# Altium project New_Thermistor_Board.PrjPcb
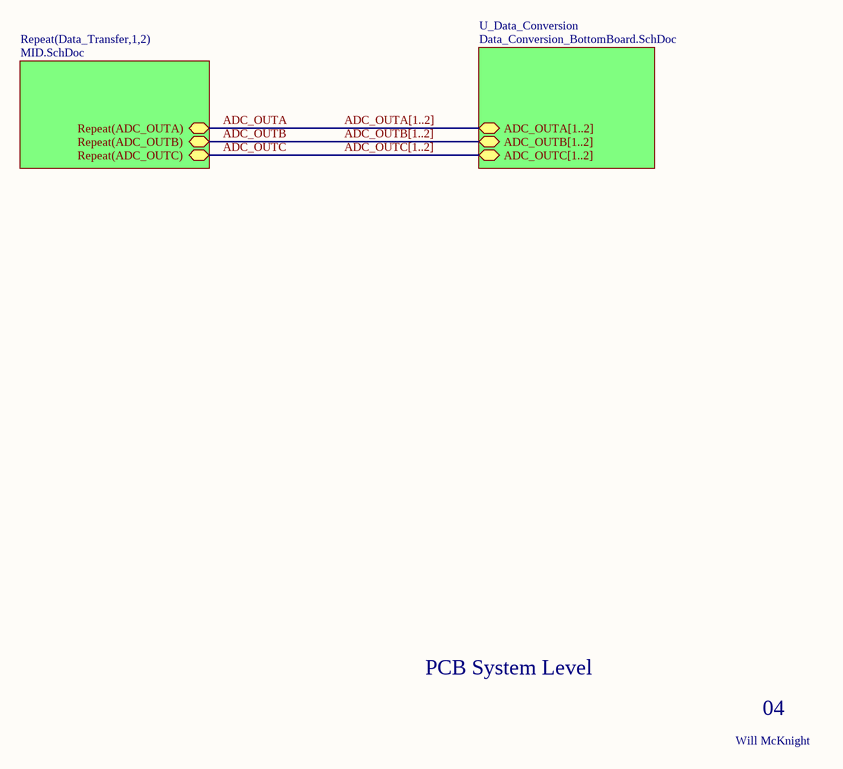
[diagram p0: TOP.SchDoc]
5 sheets, 66 parts. Net scope: hierarchical (ports join the sheet entries above them; power ports are global).
Board file: New_Bottom_Board.PcbDoc
Sheets:
  TOP.SchDoc
    Data_Transfer1 = MID.SchDoc
      U_AHK50H-ND_THERM_CONNECTOR = 50Pin_Connector.SchDoc
      U_Single_Mux = Multiplexers.SchDoc
    Data_Transfer2 = MID.SchDoc
      U_AHK50H-ND_THERM_CONNECTOR = 50Pin_Connector.SchDoc
      U_Single_Mux = Multiplexers.SchDoc
    U_Data_Conversion = Data_Conversion_BottomBoard.SchDoc

## Sheet TOP.SchDoc
size A; DocumentNumber: 2; SheetNumber: 2; SheetTotal: 5

### Sub-sheets
Repeat(Data_Transfer,1,2) = MID.SchDoc: Repeat(ADC_OUTA) (bidir), Repeat(ADC_OUTB) (bidir), Repeat(ADC_OUTC) (bidir)
U_Data_Conversion = Data_Conversion_BottomBoard.SchDoc: ADC_OUTA[1..2] (bidir), ADC_OUTB[1..2] (bidir), ADC_OUTC[1..2] (bidir)

### Nets
ADC_OUTA: sheet Repeat(Data_Transfer,1,2)/Repeat(ADC_OUTA)
ADC_OUTB: sheet Repeat(Data_Transfer,1,2)/Repeat(ADC_OUTB)
ADC_OUTC: sheet Repeat(Data_Transfer,1,2)/Repeat(ADC_OUTC)

### Buses and harness runs
bus ADC_OUTA[1..2] = sheet U_Data_Conversion/ADC_OUTA[1..2]
bus ADC_OUTB[1..2] = sheet U_Data_Conversion/ADC_OUTB[1..2]
bus ADC_OUTC[1..2] = sheet U_Data_Conversion/ADC_OUTC[1..2]

### Notes on the sheet
- PCB System Level
- 04
- Will McKnight

## Sheet MID.SchDoc
size A
Used 2 times, as channels Data_Transfer1, Data_Transfer2. Parts and nets are listed once, with the designators drawn on the sheet.
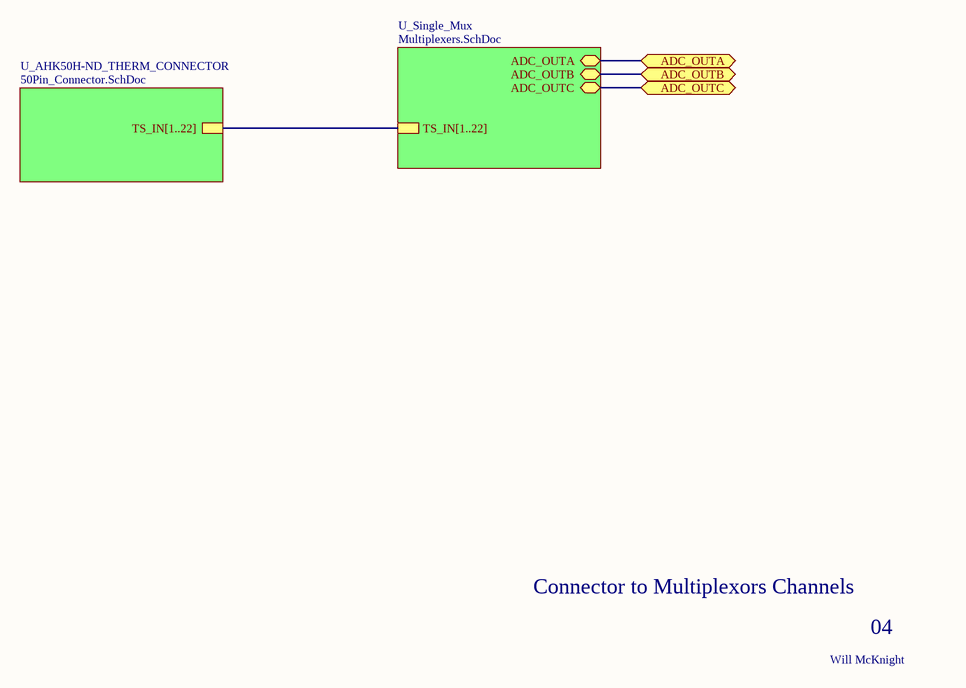
[diagram p1: MID.SchDoc]

### Sub-sheets
U_AHK50H-ND_THERM_CONNECTOR = 50Pin_Connector.SchDoc: TS_IN[1..22]
U_Single_Mux = Multiplexers.SchDoc: ADC_OUTA (bidir), TS_IN[1..22], ADC_OUTB (bidir), ADC_OUTC (bidir)

### Ports
ADC_OUTA (bidir), ADC_OUTB (bidir), ADC_OUTC (bidir)

### Nets
ADC_OUTA: port ADC_OUTA, sheet U_Single_Mux/ADC_OUTA
ADC_OUTB: port ADC_OUTB, sheet U_Single_Mux/ADC_OUTB
ADC_OUTC: port ADC_OUTC, sheet U_Single_Mux/ADC_OUTC

### Channels
Data_Transfer1: ports ADC_OUTA=ADC_OUTA ADC_OUTB=ADC_OUTB ADC_OUTC=ADC_OUTC
Data_Transfer2: ports ADC_OUTA=ADC_OUTA ADC_OUTB=ADC_OUTB ADC_OUTC=ADC_OUTC

### Buses and harness runs
bus sheet U_AHK50H-ND_THERM_CONNECTOR/TS_IN[1..22] = sheet U_Single_Mux/TS_IN[1..22]

### Notes on the sheet
- Connector to Multiplexors Channels
- 04
- Will McKnight

## Sheet 50Pin_Connector.SchDoc
size A; DocumentNumber: 1; SheetNumber: 1; SheetTotal: 5
Used 2 times, as channels Data_Transfer1/U_AHK50H-ND_THERM_CONNECTOR, Data_Transfer2/U_AHK50H-ND_THERM_CONNECTOR. Parts and nets are listed once, with the designators drawn on the sheet.
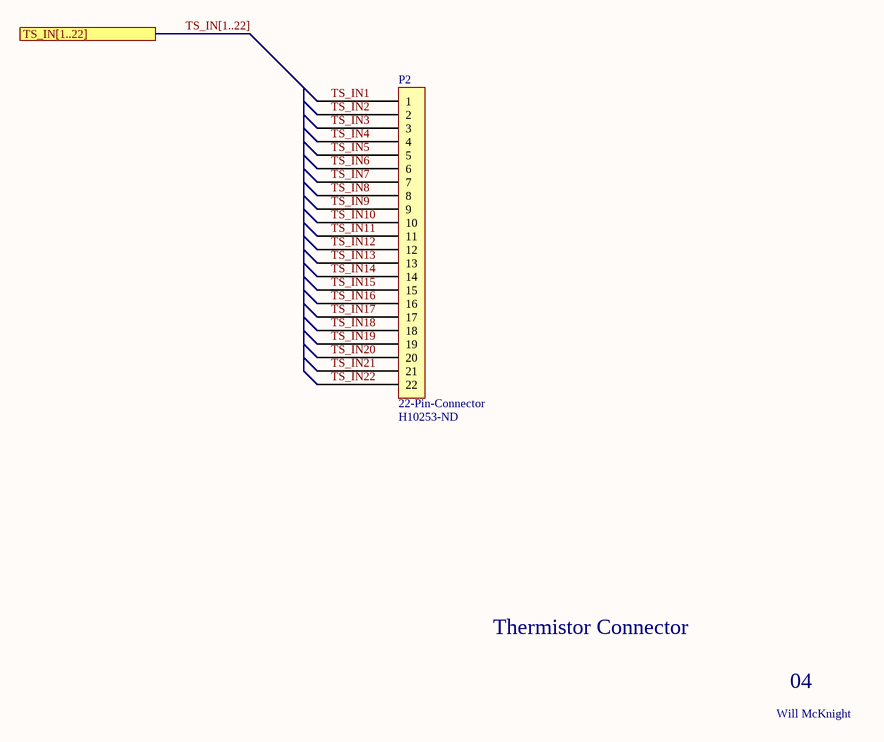
[diagram p2: 50Pin_Connector.SchDoc]

### Parts
P2  22-Pin-Connector  Supplier Part Number 1: H10253-ND  [22-Pin Conenctor]

### Ports
TS_IN[1..22]

### Nets
TS_IN1: P2.1
TS_IN2: P2.2
TS_IN3: P2.3
TS_IN4: P2.4
TS_IN5: P2.5
TS_IN6: P2.6
TS_IN7: P2.7
TS_IN8: P2.8
TS_IN9: P2.9
TS_IN10: P2.10
TS_IN11: P2.11
TS_IN12: P2.12
TS_IN13: P2.13
TS_IN14: P2.14
TS_IN15: P2.15
TS_IN16: P2.16
TS_IN17: P2.17
TS_IN18: P2.18
TS_IN19: P2.19
TS_IN20: P2.20
TS_IN21: P2.21
TS_IN22: P2.22

### Channels
Data_Transfer1/U_AHK50H-ND_THERM_CONNECTOR: designators end in _1
Data_Transfer2/U_AHK50H-ND_THERM_CONNECTOR: designators end in _2

### Buses and harness runs
bus TS_IN[1..22] = port TS_IN[1..22]

### Notes on the sheet
- Thermistor Connector
- 04
- Will McKnight

### Library data of the parts
P2 = 22-Pin-Connector: Current Therm Connector; Manufacturer: Hirose; Manufacturer Part Number: DF11-22DP-2DS(24); Number of Contacts: 22; Gender: Male; Connector Type: Male Pin; Contact Resistance: 30mR; Max Current Rating: 2A; Voltage Rating: 250V; Pitch: 2mm; Row Spacing: 0.079inch; Supplier 1: Digi-Key; Stock 1: 3536; Pricing 1: 1=1.19, 20=1.0455, 100=0.902, 500=0.738, 1000=0.656 (USD); Mount: Through Hole; Contact Plating: Tin; Contact Material: Brass,Copper Alloy,Tin; Color: Black; Housing Color: Black; Housing Material: Polyamide; Min Operating Temperature: -30°C; Max Operating Temperature: 85°C; Number of Rows: 2; Termination: Solder; Packaging: Rail/Tube; Package Quantity: 20; Fastening Type: Detent; Number of Positions: 22; Current Rating: 2A; Orientation: Right Angle; Length: 24mm; Height: 5mm; Contact Mating Length: 0.118inch; Depth: 10mm; Radiation Hardening: No; Lead Free: Lead Free; ComponentLink1URL: http://docs-usa.electrocomponents.com/techlib:/itc_doclist_US.htm?stockno=6888963&src-supplier=Allied+Electronics; ComponentLink1Description: http://docs-usa.electrocomponents.com/techlib:/itc_doclist_US.htm?stockno=6888963&src-supplier=Allied+Electronics; ComponentLink2URL: https://www.verical.com/server-webapp/html/getDatasheet?partID=456315&src-supplier=Verical; ComponentLink2Description: https://www.verical.com/server-webapp/html/getDatasheet?partID=456315&src-supplier=Verical; ComponentLink3URL: http://www.hirose.co.jp/cataloge_hp/en_DF11_20130411.pdf?src-supplier=Future+Electronics; ComponentLink3Description: http://www.hirose.co.jp/cataloge_hp/en_DF11_20130411.pdf?src-supplier=Future+Electronics; ComponentLink4URL: http://www.farnell.com/datasheets/91550.pdf?src-supplier=Element14; ComponentLink4Description: http://www.farnell.com/datasheets/91550.pdf?src-supplier=Element14; ComponentLink5URL: http://www.mouser.com/ds/2/185/DF11_catalog-1064296.pdf?src-supplier=Mouser; ComponentLink5Description: http://www.mouser.com/ds/2/185/DF11_catalog-1064296.pdf?src-supplier=Mouser; ComponentLink6URL: http://documents.rs-components.com/techlib://itc_doclist_GB.htm?stockno=6056598&src-supplier=RSComponents; ComponentLink6Description: http://documents.rs-components.com/techlib://itc_doclist_GB.htm?stockno=6056598&src-supplier=RSComponents

## Sheet Multiplexers.SchDoc
size A; DocumentNumber: 5; SheetNumber: 5; SheetTotal: 5
Used 2 times, as channels Data_Transfer1/U_Single_Mux, Data_Transfer2/U_Single_Mux. Parts and nets are listed once, with the designators drawn on the sheet.
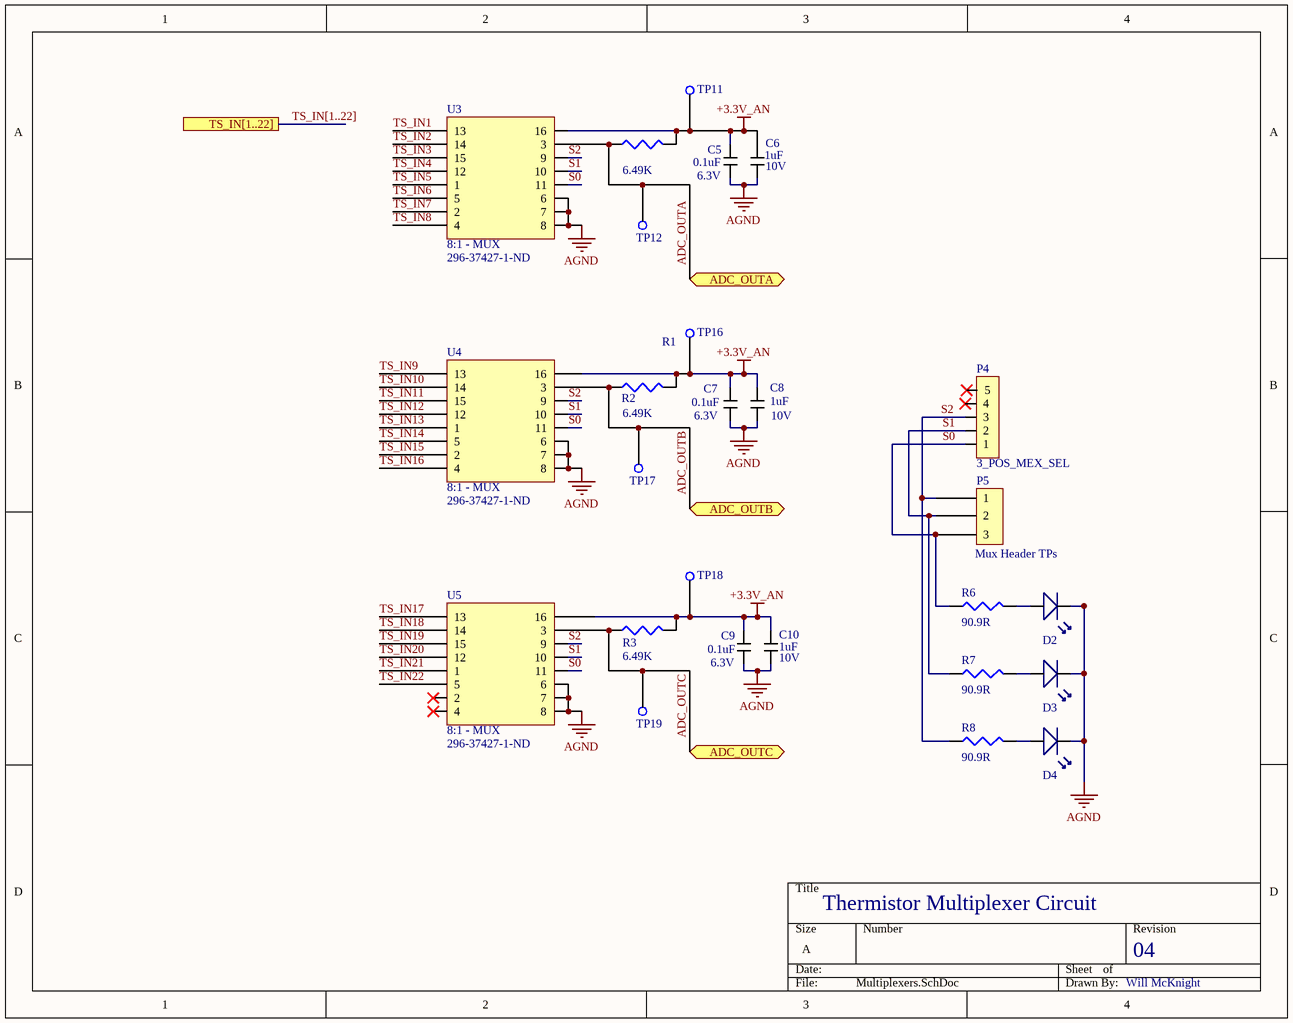
[diagram p3: Multiplexers.SchDoc]

### Parts
C5  0.1uF  Voltage Rating: 6.3V  [0.1uF Bypass Capacitor]
C6  Voltage Rating: 10V  [1UF_SAMSUNG]  (hidden comment: 1uF)
C7  0.1uF  Voltage Rating: 6.3V  [0.1uF Bypass Capacitor]
C8  Voltage Rating: 10V  [1UF_SAMSUNG]  (hidden comment: 1uF)
C9  0.1uF  Voltage Rating: 6.3V  [0.1uF Bypass Capacitor]
C10  Voltage Rating: 10V  [1UF_SAMSUNG]  (hidden comment: 1uF)
D2  LED  [Green_SMD_LED]  (value not drawn)
D3  LED  [Green_SMD_LED]  (value not drawn)
D4  LED  [Green_SMD_LED]  (value not drawn)
P4  3_POS_MEX_SEL  [3POS_MUX_SEL]
P5  3 POS Mux Select Header  [Mux Select 3 Pos Header Pin]  (value not drawn)
R1  Resistance: 6.49K  [RESC2012X06N]  (hidden comment: 6.49kOhm SMD Resistor)
R2  Resistance: 6.49K  [RESC2012X06N]  (hidden comment: 6.49kOhm SMD Resistor)
R3  Resistance: 6.49K  [RESC2012X06N]  (hidden comment: 6.49kOhm SMD Resistor)
R6  Resistance: 90.9R  [Green_LED_Resistor_90.9]  (hidden comment: Green_LED_Res)
R7  Resistance: 90.9R  [Green_LED_Resistor_90.9]  (hidden comment: Green_LED_Res)
R8  Resistance: 90.9R  [Green_LED_Resistor_90.9]  (hidden comment: Green_LED_Res)
TP11  Test Point  [Test Point]  (value not drawn)
TP12  Test Point  [Test Point]  (value not drawn)
TP16  Test Point  [Test Point]  (value not drawn)
TP17  Test Point  [Test Point]  (value not drawn)
TP18  Test Point  [Test Point]  (value not drawn)
TP19  Test Point  [Test Point]  (value not drawn)
U3  8:1 - MUX  Supplier Part Number 1: 296-37427-1-ND  [8x1 16SOIC MUX]
U4  8:1 - MUX  Supplier Part Number 1: 296-37427-1-ND  [8x1 16SOIC MUX]
U5  8:1 - MUX  Supplier Part Number 1: 296-37427-1-ND  [8x1 16SOIC MUX]

### Ports
ADC_OUTA (bidir), ADC_OUTB (bidir), ADC_OUTC (bidir), TS_IN[1..22]

### Nets
+3.3V_AN: C5.2 C6.2 C7.2 C8.2 C9.2 C10.2 R1.2 R2.2 R3.2 TP11.1 TP16.1 TP18.1 U3.16 U4.16 U5.16
AGND: C5.1 C6.1 C7.1 C8.1 C9.1 C10.1 D2.1 D3.1 D4.1 U3.6 U3.7 U3.8 U4.6 U4.7 U4.8 U5.6 U5.7 U5.8
ADC_OUTA: R1.1 TP12.1 U3.3 ; port ADC_OUTA
ADC_OUTB: R2.1 TP17.1 U4.3 ; port ADC_OUTB
ADC_OUTC: R3.1 TP19.1 U5.3 ; port ADC_OUTC
S0: P4.1 P5.3 R6.1 U3.11 U4.11 U5.11
S1: P4.2 P5.2 R7.1 U3.10 U4.10 U5.10
S2: P4.3 P5.1 R8.1 U3.9 U4.9 U5.9
TS_IN1: U3.13
TS_IN2: U3.14
TS_IN3: U3.15
TS_IN4: U3.12
TS_IN5: U3.1
TS_IN6: U3.5
TS_IN7: U3.2
TS_IN8: U3.4
TS_IN9: U4.13
TS_IN10: U4.14
TS_IN11: U4.15
TS_IN12: U4.12
TS_IN13: U4.1
TS_IN14: U4.5
TS_IN15: U4.2
TS_IN16: U4.4
TS_IN17: U5.13
TS_IN18: U5.14
TS_IN19: U5.15
TS_IN20: U5.12
TS_IN21: U5.1
TS_IN22: U5.5
NetD2_2: D2.2 R6.2
NetD3_2: D3.2 R7.2
NetD4_2: D4.2 R8.2

Not connected (* = marked no-connect by the designer): P4 4* 5*; U5 2* 4*

### Channels
Data_Transfer1/U_Single_Mux: designators C5=C5_1 C6=C6_1 C7=C7_1 C8=C8_1 C9=C9_1 C10=C10_1 D2=D2_1 D3=D3_1 D4=D4_1 P4=P4_1 P5=MUX_SEL_TP R1=R1_1 R2=R2_1 R3=R3_1 R6=R6_1 R7=R7_1 R8=R8_1 TP11=TP11_1 TP12=TP12_1 TP16=TP16_1 TP17=TP17_1 TP18=TP18_1 TP19=TP19_1 U3=U3_1 U4=U4_1 U5=U5_1; ports ADC_OUTA=ADC_OUTA ADC_OUTB=ADC_OUTB ADC_OUTC=ADC_OUTC
Data_Transfer2/U_Single_Mux: designators end in _2; ports ADC_OUTA=ADC_OUTA ADC_OUTB=ADC_OUTB ADC_OUTC=ADC_OUTC

### Buses and harness runs
bus TS_IN[1..22] = port TS_IN[1..22]

### Notes on the sheet
- (near P5) Mux Header TPs
- Thermistor Multiplexer Circuit
- 04
- Will McKnight

### Library data of the parts
C5 C7 C9 = 0.1uF Cap: 0.1uF Bypass Cap; Manufacturer: KEMET; Manufacturer Part Number: C0603C104K9RACTU; Dielectric Material: Ceramic; Tolerance: 10%; Dielectric: X7R; Dissipation Factor: 5%; Supplier 1: Digi-Key; Supplier Part Number 1: 399-15351-1-ND; RoHS: Yes; Mount: Surface Mount; Case/Package: 0603; Case Code (Imperial): 0603; Case Code (Metric): 1608; Min Operating Temperature: -55°C; Max Operating Temperature: 125°C; Package Quantity: 4000; Packaging: Tape and Reel; Voltage Rating (DC): 6.3V; Termination: SMD/SMT; Length: 1.6mm; Height: 0.8mm; Width: 0.8mm; Thickness: 0.034inch; ComponentLink1URL: https://datasheet.ciiva.com/13371/kem-c1002-x7r-smd-357932-13371879.pdf?src-supplier=Mouser; ComponentLink1Description: https://datasheet.ciiva.com/13371/kem-c1002-x7r-smd-357932-13371879.pdf?src-supplier=Mouser; Stock 1: 758; Pricing 1: 1=0.19000, 10=0.13800, 100=0.06480, 500=0.04546, 1000=0.03763 (USD)
C6 C8 C10 = 1uF Samsung Cap: Manufacturer Part Number: CL10B105KP8NNNC; Tolerance: 10%; Dielectric: X7R; Supplier 1: Digi-Key; Supplier Part Number 1: 1276-1946-1-ND; Manufacturer: Samsung; Mount: Surface Mount; Case/Package: 0603; Case Code (Metric): 1608; Case Code (Imperial): 0603; Contact Plating: Tin; Min Operating Temperature: -55°C; Max Operating Temperature: 125°C; Package Quantity: 1; Packaging: Tape and Reel; Voltage Rating (DC): 10V; Length: 1.6mm; Height: 0.8mm; Width: 0.031inch; Thickness: 0.035inch; Depth: 0.8mm; Radiation Hardening: No; Lead Free: Lead Free; ComponentLink1URL: https://media.digikey.com/pdf/Data%20Sheets/Samsung%20PDFs/CL_Series_MLCC_ds.pdf?src-supplier=Digi-Key; ComponentLink1Description: https://media.digikey.com/pdf/Data%20Sheets/Samsung%20PDFs/CL_Series_MLCC_ds.pdf?src-supplier=Digi-Key; ComponentLink2URL: http://www1.futureelectronics.com/doc/SAMSUNG/CL10B105KP8NNNC.pdf?src-supplier=Future+Electronics; ComponentLink2Description: http://www1.futureelectronics.com/doc/SAMSUNG/CL10B105KP8NNNC.pdf?src-supplier=Future+Electronics; ComponentLink3URL: https://www.verical.com/server-webapp/html/getDatasheet?partID=358410&src-supplier=Verical; ComponentLink3Description: https://www.verical.com/server-webapp/html/getDatasheet?partID=358410&src-supplier=Verical; Stock 1: 10781730; Pricing 1: 1=0.1, 10=0.052, 100=0.0233, 500=0.0166, 1000=0.0131 (USD); Capacitance: 1uF
D2-D4 = GREEN_LED: Manufacturer: Dialight; Manufacturer Part Number: 5988070107F; Color: Green; Lens Color: Colorless,Clear; Forward Voltage: 2V; Forward Current: 20mA; Wavelength: 570nm; Luminous Intensity: 20mcd; Viewing Angle: 140°; Lens Style: Flat,Rectangular,Diffused,Colorless,Clear; Dominant Wavelength: 568nm; Number of Elements: 1; Power Dissipation: 60mW; Reverse Voltage: 5V; Lens Transparency: Clear; Lens Size: 0.8mm; Supplier 1: Digi-Key; Stock 1: 228546; Pricing 1: 1=0.46, 10=0.33, 25=0.2528, 100=0.1648, 250=0.1209, 500=0.1026, 1000=0.0843 (USD); Mount: Surface Mount; Case/Package: 0603; Number of Pins: 2; Case Code (Metric): 1608; Case Code (Imperial): 0603; Min Operating Temperature: -30°C; Max Operating Temperature: 100°C; Package Quantity: 4000; Packaging: Tape and Reel; Illumination Color: Green; Test Current: 20mA; Number of LEDs: 1; Length: 1.6mm; Height: 0.7mm; Depth: 0.8mm; Width: 0.8mm; Radiation Hardening: No; Lead Free: Lead Free; REACH SVHC: No SVHC; ComponentLink1URL: http://www.mouser.com/ds/2/109/SMT_selector_guide-267443.pdf?src-supplier=Mouser; ComponentLink1Description: http://www.mouser.com/ds/2/109/SMT_selector_guide-267443.pdf?src-supplier=Mouser; ComponentLink2URL: http://uk.rs-online.com/webdocs/0ae2/0900766b80ae2975.pdf?src-supplier=RSComponents; ComponentLink2Description: http://uk.rs-online.com/webdocs/0ae2/0900766b80ae2975.pdf?src-supplier=RSComponents; ComponentLink3URL: http://www.farnell.com/datasheets/1720200.pdf?src-supplier=Element14; ComponentLink3Description: http://www.farnell.com/datasheets/1720200.pdf?src-supplier=Element14; ComponentLink4URL: https://media.digikey.com/pdf/Data%20Sheets/Dialight%20PDFs/598_Series_0603_Pkg.pdf?src-supplier=Digi-Key; ComponentLink4Description: https://media.digikey.com/pdf/Data%20Sheets/Dialight%20PDFs/598_Series_0603_Pkg.pdf?src-supplier=Digi-Key; ComponentLink5URL: http://www.farnell.com/datasheets/1484480.pdf?src-supplier=Element14; ComponentLink5Description: http://www.farnell.com/datasheets/1484480.pdf?src-supplier=Element14; ComponentLink6URL: https://www.alliedelec.com/m/d/745256ca487aea7b70ea31e2d673d5bb.pdf?src-supplier=Allied+Electronics; ComponentLink6Description: https://www.alliedelec.com/m/d/745256ca487aea7b70ea31e2d673d5bb.pdf?src-supplier=Allied+Electronics; ComponentLink7URL: http://www.onlinecomponents.com/productFiles/mf-DIA/mdei5980603.pdf?src-supplier=Onlinecomponents.com; ComponentLink7Description: http://www.onlinecomponents.com/productFiles/mf-DIA/mdei5980603.pdf?src-supplier=Onlinecomponents.com; ComponentLink8URL: https://www.verical.com/server-webapp/html/getDatasheet?partID=146438&src-supplier=Verical; ComponentLink8Description: https://www.verical.com/server-webapp/html/getDatasheet?partID=146438&src-supplier=Verical; ComponentLink9URL: http://www.dialight.com/Assets/Brochures_And_Catalogs/Indication/SMT_selector_guide.pdf?src-supplier=Future+Electronics; ComponentLink9Description: http://www.dialight.com/Assets/Brochures_And_Catalogs/Indication/SMT_selector_guide.pdf?src-supplier=Future+Electronics; Supplier Part Number 1: 350-2035-1-ND
P4 = 3_POS_MEX_SEL: Connector Header Surface Mount, Right Angle 3 position 0.049" (1.25mm); Manufacturer: Molex; Manufacturer Part Number: 505567-0371; Connector Type: Header,Male Pin; Number of Positions: 3; Supplier 1: Digi-Key; Stock 1: 2041; Pricing 1: 1=0.84000, 10=0.74100, 100=0.63940, 500=0.52312 (USD); RoHS: No; Mount: Surface Mount; Contact Plating: Tin; Contact Material: Brass; Contact Shape: Square; Insulation Material: Nylon; Insulation Color: Black; Min Operating Temperature: -40°C; Max Operating Temperature: 105°C; Fastening Type: Ramp; Packaging: Cut Tape; Number of Rows: 1; Termination: Solder; Flammability Rating: UL94 V-0; ComponentLink1URL: https://www.molex.com/pdm_docs/sd/5055670371_sd.pdf?src-supplier=Digi-Key; ComponentLink1Description: https://www.molex.com/pdm_docs/sd/5055670371_sd.pdf?src-supplier=Digi-Key; ComponentLink2URL: http://www.farnell.com/datasheets/2551041.pdf?src-supplier=Newark; ComponentLink2Description: http://www.farnell.com/datasheets/2551041.pdf?src-supplier=Newark
P5 = 3 POS Mux Select Header: Mux Sel Header TP; Manufacturer: Adam Equipment; Manufacturer Part Number: PH1RA-03-UA; Supplier 1: Digi-Key; Stock 1: 4630; Pricing 1: 1=0.12000, 10=0.11300, 100=0.06960, 500=0.05760, 1000=0.05040, 5000=0.04320, 10000=0.04200 (USD); RoHS: Yes; Lead Free: Lead Free; ComponentLink1URL: https://datasheet.ciiva.com/16476/page-292-295-16476086.pdf?src-supplier=Future+Electronics; ComponentLink1Description: https://datasheet.ciiva.com/16476/page-292-295-16476086.pdf?src-supplier=Future+Electronics; Supplier Part Number 1: 2057-PH1RA-03-UA-ND
R1-R3 = 6.49kOhm SMD Resistor: Manufacturer: Panasonic; Manufacturer Part Number: ERA6AEB6491V; Tolerance: 0.1%; Temperature Coefficient: 25ppm/°C; Power Rating: 125mW; Voltage Rating: 100V; Supplier 1: Digi-Key; Stock 1: 15147; Pricing 1: 1=0.36, 10=0.302, 100=0.1182, 1000=0.0495, 2500=0.0454 (USD); Mount: Surface Mount; Case/Package: 0805; Number of Pins: 2; Contact Plating: Tin; Case Code (Metric): 2012; Case Code (Imperial): 0805; Min Operating Temperature: -55°C; Max Operating Temperature: 155°C; Composition: Thin Film,Metal Film; Packaging: Tape and Reel; Package Quantity: 1; Number of Terminations: 2; Termination: SMD/SMT; Military Standard: Not; Max Power Dissipation: 125mW; Voltage Rating (DC): 100V; Features: Automotive AEC-Q200; Length: 2mm; Height: 0.5mm; Width: 1.25mm; Depth: 1.25mm; Radiation Hardening: No; REACH SVHC: No SVHC; Lead Free: Lead Free; ComponentLink1URL: http://www.farnell.com/datasheets/485442.pdf?src-supplier=Farnell; ComponentLink1Description: http://www.farnell.com/datasheets/485442.pdf?src-supplier=Farnell; ComponentLink2URL: http://www.mouser.com/ds/2/315/AOA0000CE26-32660.pdf?src-supplier=Mouser; ComponentLink2Description: http://www.mouser.com/ds/2/315/AOA0000CE26-32660.pdf?src-supplier=Mouser; ComponentLink3URL: http://www.farnell.com/datasheets/2059650.pdf?src-supplier=Farnell; ComponentLink3Description: http://www.farnell.com/datasheets/2059650.pdf?src-supplier=Farnell; ComponentLink4URL: http://uk.rs-online.com/webdocs/0eb1/0900766b80eb1d8c.pdf?src-supplier=RSComponents; ComponentLink4Description: http://uk.rs-online.com/webdocs/0eb1/0900766b80eb1d8c.pdf?src-supplier=RSComponents; ComponentLink5URL: http://www.farnell.com/datasheets/485442.pdf?src-supplier=Element14; ComponentLink5Description: http://www.farnell.com/datasheets/485442.pdf?src-supplier=Element14; ComponentLink6URL: http://www.produktinfo.conrad.com/datenblaetter/1100000-1199999/001181295-da-01-en-WIDERSTAND_ERA_0805_6K49_0_1__5000ST.pdf?src-supplier=Conrad; ComponentLink6Description: http://www.produktinfo.conrad.com/datenblaetter/1100000-1199999/001181295-da-01-en-WIDERSTAND_ERA_0805_6K49_0_1__5000ST.pdf?src-supplier=Conrad; Supplier Part Number 1: P6.49KDACT-ND
R6-R8 = Green_LED_Res: Manufacturer: Panasonic; Manufacturer Part Number: ERJ-1GNF90R9C; Power Rating: 50mW; Tolerance: 1%; Voltage Rating: 25V; Temperature Coefficient: 200ppm/°C; Voltage Rating (DC): 50V; Mount: Surface Mount; Case/Package: 0201; Case Code (Imperial): 0201; Case Code (Metric): 0603; Contact Plating: Tin,Matte; Min Operating Temperature: -55°C; Max Operating Temperature: 125°C; Package Quantity: 15000; Packaging: Tape and Reel; Composition: Thick Film; Number of Terminations: 2; Max Power Dissipation: 50mW; Termination: SMD/SMT; Length: 0.024inch; Height: 0.01inch; Width: 0.3mm; Radiation Hardening: No; Supplier 1: Digi-Key; Stock 1: 401780; Pricing 1: 1=0.10000, 10=0.02400, 100=0.00970, 1000=0.00437, 2500=0.00379 (USD); RoHS: Yes; Military Standard: Not; Depth: 0.8mm; Lead Free: Lead Free; ComponentLink1URL: https://datasheet.ciiva.com/15189/getdatasheetpartid-326528-15189836.pdf?src-supplier=Verical; ComponentLink1Description: https://datasheet.ciiva.com/15189/getdatasheetpartid-326528-15189836.pdf?src-supplier=Verical; ComponentLink2URL: https://datasheet.ciiva.com/12558/rc0603-272842-12558285.pdf?src-supplier=Mouser; ComponentLink2Description: https://datasheet.ciiva.com/12558/rc0603-272842-12558285.pdf?src-supplier=Mouser; Supplier Part Number 1: 311-90.9HRCT-ND
U3-U5 = 8:1 - MUX: Current Therm 8:1 Mux; Manufacturer: Texas Instruments; Manufacturer Part Number: SN74LV4051ATPWRQ1; Max Supply Voltage: 5.5V; Min Supply Voltage: 2V; Bandwidth: 35MHz; Propagation Delay: 7ns; Number of Channels: 1; Number of Inputs: 8; Logic Function: Multiplexer,Demultiplexer; On-State Resistance: 75R; Operating Supply Current: 20uA; Turn-On Delay Time: 20ns; Supply Type: Single; High Level Output Current: 25mA; Supplier 1: Digi-Key; Stock 1: 2492; Pricing 1: 1=0.72000, 10=0.63600, 100=0.48730, 500=0.38522, 1000=0.30818 (USD); Mount: Surface Mount; Case/Package: TSSOP; Number of Pins: 16; Weight: 0.002169oz; Contact Plating: Gold; Min Operating Temperature: -40°C; Max Operating Temperature: 105°C; Package Quantity: 1; Packaging: Tape and Reel; Number of Outputs: 1; Turn-Off Delay Time: 20ns; Number of Circuits: 1; Number of Bits: 8; Low Level Output Current: 25mA; Radiation Hardening: No; REACH SVHC: No SVHC; Lead Free: Lead Free; ComponentLink1URL: http://www.ti.com/lit/ds/symlink/sn74lv4051a-q1.pdf?src-supplier=Digi-Key; ComponentLink1Description: http://www.ti.com/lit/ds/symlink/sn74lv4051a-q1.pdf?src-supplier=Digi-Key; ComponentLink2URL: http://www.ti.com/lit/gpn/sn74lv4051a-q1?src-supplier=Mouser; ComponentLink2Description: http://www.ti.com/lit/gpn/sn74lv4051a-q1?src-supplier=Mouser; ComponentLink3URL: https://www.verical.com/server-webapp/html/getDatasheet?partID=137249&src-supplier=Verical; ComponentLink3Description: https://www.verical.com/server-webapp/html/getDatasheet?partID=137249&src-supplier=Verical; ComponentLink4URL: http://focus.ti.com/lit/ds/symlink/sn74lv4051a-q1.pdf?src-supplier=Avnet; ComponentLink4Description: http://focus.ti.com/lit/ds/symlink/sn74lv4051a-q1.pdf?src-supplier=Avnet; ComponentLink5URL: http://www.produktinfo.conrad.com/datenblaetter/1100000-1199999/001187277-da-01-en-IC_MUX_DE_SN74LV4051ATPWRQ1_TSSOP_16_TID.pdf?src-supplier=Conrad; ComponentLink5Description: http://www.produktinfo.conrad.com/datenblaetter/1100000-1199999/001187277-da-01-en-IC_MUX_DE_SN74LV4051ATPWRQ1_TSSOP_16_TID.pdf?src-supplier=Conrad; RoHS: Yes; -3db Bandwidth: 35MHz; ComponentLink6URL: https://datasheet.ciiva.com/15127/getdatasheetpartid-348177-15127781.pdf?src-supplier=Verical; ComponentLink6Description: https://datasheet.ciiva.com/15127/getdatasheetpartid-348177-15127781.pdf?src-supplier=Verical; ComponentLink7URL: https://datasheet.ciiva.com/14435/sn74lv4051a-q1-14435640.pdf?src-supplier=Avnet; ComponentLink7Description: https://datasheet.ciiva.com/14435/sn74lv4051a-q1-14435640.pdf?src-supplier=Avnet; ComponentLink8URL: https://datasheet.ciiva.com/29645/sn74lv4051a-q1-29645693.pdf?src-supplier=Digi-Key; ComponentLink8Description: https://datasheet.ciiva.com/29645/sn74lv4051a-q1-29645693.pdf?src-supplier=Digi-Key; ComponentLink9URL: https://datasheet.ciiva.com/29645/sn74lv4051a-q1-29645694.pdf?src-supplier=Digi-Key; ComponentLink9Description: https://datasheet.ciiva.com/29645/sn74lv4051a-q1-29645694.pdf?src-supplier=Digi-Key; ComponentLink10URL: https://datasheet.ciiva.com/29645/sn74lv4051a-q1-29645695.pdf?src-supplier=Digi-Key; ComponentLink10Description: https://datasheet.ciiva.com/29645/sn74lv4051a-q1-29645695.pdf?src-supplier=Digi-Key

## Sheet Data_Conversion_BottomBoard.SchDoc
size A
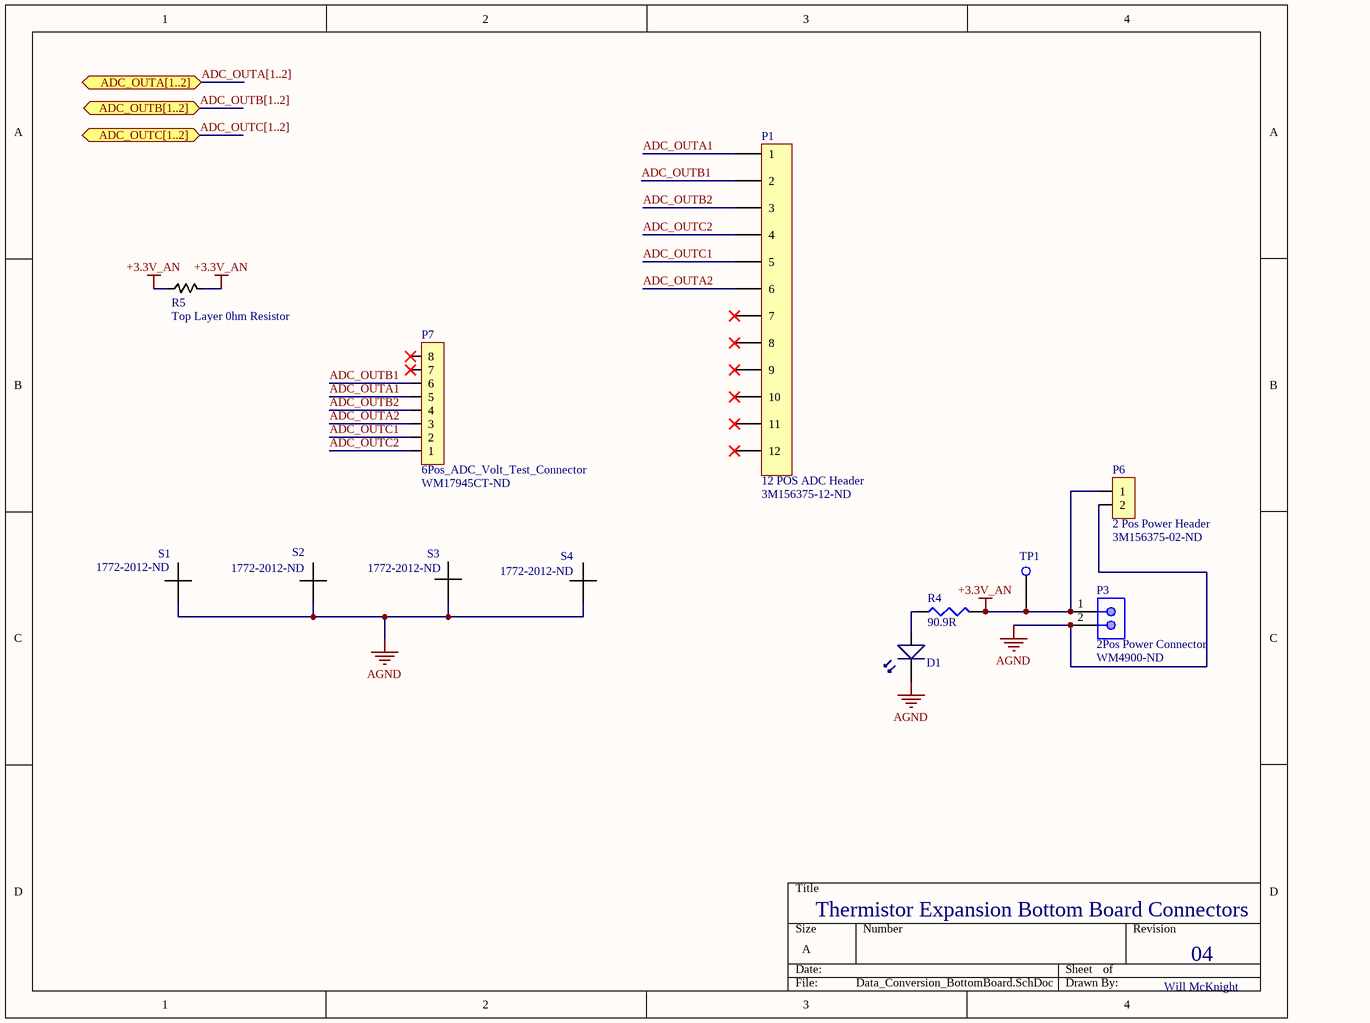
[diagram p4: Data_Conversion_BottomBoard.SchDoc]

### Parts
D1  LED  [Green_SMD_LED]  (value not drawn)
P1  12 POS ADC Header  Supplier Part Number 1: 3M156375-12-ND  [12 POS Dual Header]
P3  2Pos Power Connector  Supplier Part Number 1: WM4900-ND  [2Pos Power Connector]
P6  2 Pos Power Header  Supplier Part Number 1: 3M156375-02-ND  [2 POS Power Header]
P7  6Pos_ADC_Volt_Test_Connector  Supplier Part Number 1: WM17945CT-ND  [6POS_ADC_Volt_TEST]
R4  Resistance: 90.9R  [Green_LED_Resistor_90.9]  (hidden comment: Green)
R5  Top Layer 0hm Resistor  [Top Layer 0ohm Resistor]
S1  Supplier Part Number 1: 1772-2012-ND  [#6-32 Female-Male Standoff]  (hidden comment: #6-32 Female-Male Standoff)
S2  Supplier Part Number 1: 1772-2012-ND  [#6-32 Female-Male Standoff]  (hidden comment: #6-32 Female-Male Standoff)
S3  Supplier Part Number 1: 1772-2012-ND  [#6-32 Female-Male Standoff]  (hidden comment: #6-32 Female-Male Standoff)
S4  Supplier Part Number 1: 1772-2012-ND  [#6-32 Female-Male Standoff]  (hidden comment: #6-32 Female-Male Standoff)
TP1  Test Point  [Test Point]  (value not drawn)

### Ports
ADC_OUTA[1..2] (bidir), ADC_OUTB[1..2] (bidir), ADC_OUTC[1..2] (bidir)

### Nets
+3.3V_AN: P3.1 P6.1 R4.2 R5.1 R5.2 TP1.1
AGND: D1.1 P3.2 P6.2 S1.1 S2.1 S3.1 S4.1
ADC_OUTA1: P1.1 P7.5  [project net ADC_OUTA]
ADC_OUTA2: P1.6 P7.3  [project net ADC_OUTA]
ADC_OUTB1: P1.2 P7.6  [project net ADC_OUTB]
ADC_OUTB2: P1.3 P7.4  [project net ADC_OUTB]
ADC_OUTC1: P1.5 P7.2  [project net ADC_OUTC]
ADC_OUTC2: P1.4 P7.1  [project net ADC_OUTC]
NetD1_2: D1.2 R4.1

Not connected (* = marked no-connect by the designer): P1 7* 8* 9* 10* 11* 12*; P7 7* 8*

### Buses and harness runs
bus ADC_OUTA[1..2] = port ADC_OUTA[1..2]
bus ADC_OUTB[1..2] = port ADC_OUTB[1..2]
bus ADC_OUTC[1..2] = port ADC_OUTC[1..2]

### Notes on the sheet
- Thermistor Expansion Bottom Board Connectors
- 04
- Will McKnight

### Library data of the parts
D1 = GREEN_LED: as D2 on sheet Multiplexers; Supplier 1: Digi-Key; Stock 1: 228546; Pricing 1: 1=0.46, 10=0.33, 25=0.2528, 100=0.1648, 250=0.1209, 500=0.1026, 1000=0.0843 (USD); Mount: Surface Mount; Case/Package: 0603; Number of Pins: 2; Case Code (Metric): 1608; Case Code (Imperial): 0603; Min Operating Temperature: -30°C; Max Operating Temperature: 100°C; Package Quantity: 4000; Packaging: Tape and Reel; Illumination Color: Green; Test Current: 20mA; Number of LEDs: 1; Length: 1.6mm; Height: 0.7mm; Depth: 0.8mm; Width: 0.8mm; Radiation Hardening: No; Lead Free: Lead Free; REACH SVHC: No SVHC; ComponentLink1URL: http://www.mouser.com/ds/2/109/SMT_selector_guide-267443.pdf?src-supplier=Mouser; ComponentLink1Description: http://www.mouser.com/ds/2/109/SMT_selector_guide-267443.pdf?src-supplier=Mouser; ComponentLink2URL: http://uk.rs-online.com/webdocs/0ae2/0900766b80ae2975.pdf?src-supplier=RSComponents; ComponentLink2Description: http://uk.rs-online.com/webdocs/0ae2/0900766b80ae2975.pdf?src-supplier=RSComponents; ComponentLink3URL: http://www.farnell.com/datasheets/1720200.pdf?src-supplier=Element14; ComponentLink3Description: http://www.farnell.com/datasheets/1720200.pdf?src-supplier=Element14; ComponentLink4URL: https://media.digikey.com/pdf/Data%20Sheets/Dialight%20PDFs/598_Series_0603_Pkg.pdf?src-supplier=Digi-Key; ComponentLink4Description: https://media.digikey.com/pdf/Data%20Sheets/Dialight%20PDFs/598_Series_0603_Pkg.pdf?src-supplier=Digi-Key; ComponentLink5URL: http://www.farnell.com/datasheets/1484480.pdf?src-supplier=Element14; ComponentLink5Description: http://www.farnell.com/datasheets/1484480.pdf?src-supplier=Element14; ComponentLink6URL: https://www.alliedelec.com/m/d/745256ca487aea7b70ea31e2d673d5bb.pdf?src-supplier=Allied+Electronics; ComponentLink6Description: https://www.alliedelec.com/m/d/745256ca487aea7b70ea31e2d673d5bb.pdf?src-supplier=Allied+Electronics; ComponentLink7URL: http://www.onlinecomponents.com/productFiles/mf-DIA/mdei5980603.pdf?src-supplier=Onlinecomponents.com; ComponentLink7Description: http://www.onlinecomponents.com/productFiles/mf-DIA/mdei5980603.pdf?src-supplier=Onlinecomponents.com; ComponentLink8URL: https://www.verical.com/server-webapp/html/getDatasheet?partID=146438&src-supplier=Verical; ComponentLink8Description: https://www.verical.com/server-webapp/html/getDatasheet?partID=146438&src-supplier=Verical; ComponentLink9URL: http://www.dialight.com/Assets/Brochures_And_Catalogs/Indication/SMT_selector_guide.pdf?src-supplier=Future+Electronics; ComponentLink9Description: http://www.dialight.com/Assets/Brochures_And_Catalogs/Indication/SMT_selector_guide.pdf?src-supplier=Future+Electronics; Supplier Part Number 1: 350-2035-1-ND
P1 = 12 POS ADC Header: Interboard connector for thermistors connecting to ADC; Manufacturer: 3M; Manufacturer Part Number: 929715-06-06-EU; Number of Positions: 12; Connector Type: Male Pin; Gender: Male; Pitch: 0.1inch; Supplier 1: Digi-Key; Stock 1: 0; Pricing 1: 1=1.86000, 10=1.69000, 25=1.58600, 50=1.51720, 100=1.44820, 250=1.31024, 500=1.20680 (USD); RoHS: Yes; Mount: Through Hole; Contact Plating: Gold; Color: Black; Number of Rows: 2; Packaging: Bulk; Termination: Solder; Package Quantity: 500; Row Spacing: 0.1inch; Contact Mating Length: 0.318inch; ComponentLink1URL: http://www.mouser.com/ds/2/1/ts0769-35914.pdf?src-supplier=Mouser; ComponentLink1Description: http://www.mouser.com/ds/2/1/ts0769-35914.pdf?src-supplier=Mouser; ComponentLink2URL: http://components.arrow.com/part/dataview/42715320S8912076N3321?src-supplier=Arrow; ComponentLink2Description: http://components.arrow.com/part/dataview/42715320S8912076N3321?src-supplier=Arrow; ComponentLink3URL: http://multimedia.3m.com/mws/mediawebserver?66666UuZjcFSLXTtmXME5x46EVuQEcuZgVs6EVs6E666666--?src-supplier=Digi-Key; ComponentLink3Description: http://multimedia.3m.com/mws/mediawebserver?66666UuZjcFSLXTtmXME5x46EVuQEcuZgVs6EVs6E666666--?src-supplier=Digi-Key; System: Connector
P3 = 2Pos Power Connector: Headers & Wire Housings R/A HDR 2P low profile single; Manufacturer: Molex; Manufacturer Part Number: 70553-0001; Current Rating: 3A; Voltage Rating: 250V; Contact Resistance: 30mR; Number of Positions: 2; Gender: Male; Insulation Resistance: 1GR; Pitch: 2.54mm; Approvals: UL; Glow Wire Compliant: Non-compliant; Supplier 1: Digi-Key; Stock 1: 8671; Pricing 1: 1=0.71000, 72=0.53486, 144=0.51264, 504=0.44575, 1008=0.36775, 5040=0.32318, 10008=0.30089 (USD); RoHS: Yes; Mount: Through Hole; Contact Material: Bronze; Contact Plating: Gold; Color: Black; Housing Color: Black; Material: Brass; Housing Material: Thermoplastic; Min Operating Temperature: -40°C; Max Operating Temperature: 105°C; Package Quantity: 2880; Number of Rows: 1; Packaging: Rail/Tube; Termination: Through Hole; Number of Contacts: 2; Orientation: Right Angle; Number of Circuits: 2; Voltage Rating (DC): 250V; Radiation Hardening: No; REACH SVHC: Unknown; Lead Free: Lead Free; Flammability Rating: UL94 V-0; ELV: Compliant; ComponentLink1URL: https://datasheet.ciiva.com/5158/0705530001-pcb-headers-172944-5158768.pdf?src-supplier=Mouser; ComponentLink1Description: https://datasheet.ciiva.com/5158/0705530001-pcb-headers-172944-5158768.pdf?src-supplier=Mouser; ComponentLink2URL: https://datasheet.ciiva.com/11746/0900766b80d8d649-11746625.pdf?src-supplier=RSComponents; ComponentLink2Description: https://datasheet.ciiva.com/11746/0900766b80d8d649-11746625.pdf?src-supplier=RSComponents; ComponentLink3URL: https://datasheet.ciiva.com/16657/0705530001-pcb-headers-16657777.pdf?src-supplier=Avnet+Europe; ComponentLink3Description: https://datasheet.ciiva.com/16657/0705530001-pcb-headers-16657777.pdf?src-supplier=Avnet+Europe; ComponentLink4URL: https://datasheet.ciiva.com/7920/ps-70541-7920854.pdf?src-supplier=Element14; ComponentLink4Description: https://datasheet.ciiva.com/7920/ps-70541-7920854.pdf?src-supplier=Element14; ComponentLink5URL: https://datasheet.ciiva.com/30195/179180705530001-pcb-headers-30195548.pdf?src-supplier=Onlinecomponents.com; ComponentLink5Description: https://datasheet.ciiva.com/30195/179180705530001-pcb-headers-30195548.pdf?src-supplier=Onlinecomponents.com; ComponentLink6URL: https://datasheet.ciiva.com/1438/1887076-1438989.pdf?src-supplier=Element14; ComponentLink6Description: https://datasheet.ciiva.com/1438/1887076-1438989.pdf?src-supplier=Element14; ComponentLink7URL: https://datasheet.ciiva.com/10090/0705530001-pcb-headers-10090317.pdf?src-supplier=Avnet; ComponentLink7Description: https://datasheet.ciiva.com/10090/0705530001-pcb-headers-10090317.pdf?src-supplier=Avnet
P6 = 2 Pos Power Header: Manufacturer: 3M; Manufacturer Part Number: 929715-06-01-EU; Gender: Male; Number of Positions: 2; Connector Type: Male Pin; Current Rating: 2.5A; Pitch: 2.54mm; Row Spacing: 0.1inch; Supplier 1: Digi-Key; Stock 1: 0; Pricing 1: 1=0.43000, 10=0.40200, 25=0.34480, 50=0.29300, 100=0.28160, 250=0.25284, 500=0.24136 (USD); RoHS: Yes; Mount: Through Hole; Contact Plating: Gold; Color: Black; Contact Material: Copper Alloy; Housing Material: Polycyclohexylenedimethylene; Min Operating Temperature: -40°C; Max Operating Temperature: 105°C; Number of Rows: 2; Packaging: Bulk; Termination: Solder; Package Quantity: 1000; Contact Gender: Male; Contact Mating Length: 0.318inch; ComponentLink1URL: https://datasheet.ciiva.com/5147/ts0769-35914-5147696.pdf?src-supplier=Mouser; ComponentLink1Description: https://datasheet.ciiva.com/5147/ts0769-35914-5147696.pdf?src-supplier=Mouser; ComponentLink2URL: https://datasheet.ciiva.com/6818/ts0769-6818155.pdf?src-supplier=Digi-Key; ComponentLink2Description: https://datasheet.ciiva.com/6818/ts0769-6818155.pdf?src-supplier=Digi-Key
P7 = 6Pos_ADC_Volt_Test_Connector: Connector Header Surface Mount, Right Angle 6 position 0.079" (2.00mm); Manufacturer: Molex; Manufacturer Part Number: 5055780671; Supplier 1: Digi-Key; Stock 1: 3435; Pricing 1: 1=1.02000, 10=0.89300, 100=0.77050 (USD); RoHS: No
R4 = Green_LED_Res: as R6 on sheet Multiplexers; Mount: Surface Mount; Case/Package: 0201; Case Code (Imperial): 0201; Case Code (Metric): 0603; Contact Plating: Tin,Matte; Min Operating Temperature: -55°C; Max Operating Temperature: 125°C; Package Quantity: 15000; Packaging: Tape and Reel; Composition: Thick Film; Number of Terminations: 2; Max Power Dissipation: 50mW; Termination: SMD/SMT; Length: 0.024inch; Height: 0.01inch; Width: 0.3mm; Radiation Hardening: No; Supplier 1: Digi-Key; Stock 1: 401780; Pricing 1: 1=0.10000, 10=0.02400, 100=0.00970, 1000=0.00437, 2500=0.00379 (USD); RoHS: Yes; Military Standard: Not; Depth: 0.8mm; Lead Free: Lead Free; ComponentLink1URL: https://datasheet.ciiva.com/15189/getdatasheetpartid-326528-15189836.pdf?src-supplier=Verical; ComponentLink1Description: https://datasheet.ciiva.com/15189/getdatasheetpartid-326528-15189836.pdf?src-supplier=Verical; ComponentLink2URL: https://datasheet.ciiva.com/12558/rc0603-272842-12558285.pdf?src-supplier=Mouser; ComponentLink2Description: https://datasheet.ciiva.com/12558/rc0603-272842-12558285.pdf?src-supplier=Mouser; Supplier Part Number 1: 311-90.9HRCT-ND
S1-S4 = #6-32 Female-Male Standoff: Hex Standoff Threaded #6-32 Aluminum 0.375" (9.53mm) 3/8"; Manufacturer: RAF; Manufacturer Part Number: 4532-632-AL-7; Plating: Iridite; Gender: Male to Female; System: Connector; Supplier 1: Digi-Key; Stock 1: 6226; Pricing 1: 1=0.43000, 25=0.28720, 100=0.24440, 250=0.23220, 500=0.21996, 1000=0.20774 (USD); RoHS: Yes; Mount: Hardware; Case/Package: Aluminum; Material: Aluminium; Shape: Hex; Packaging: Bulk; Package Quantity: 100; Length: 0.375inch; REACH SVHC: Unknown; ComponentLink1URL: https://datasheet.ciiva.com/7374/1232651-7374258.pdf?src-supplier=Newark; ComponentLink1Description: https://datasheet.ciiva.com/7374/1232651-7374258.pdf?src-supplier=Newark; ComponentLink2URL: https://datasheet.ciiva.com/5226/4532-632-al-7-198196-5226842.pdf?src-supplier=Mouser; ComponentLink2Description: https://datasheet.ciiva.com/5226/4532-632-al-7-198196-5226842.pdf?src-supplier=Mouser; ComponentLink3URL: https://datasheet.ciiva.com/7921/1232651-7921382.pdf?src-supplier=Element14; ComponentLink3Description: https://datasheet.ciiva.com/7921/1232651-7921382.pdf?src-supplier=Element14

## Nets that join several sheets
+3.3V_AN: Data_Transfer1/U_Single_Mux (15 pins), Data_Transfer2/U_Single_Mux (15 pins), Data_Conversion_BottomBoard (6 pins)
AGND: Data_Transfer1/U_Single_Mux (18 pins), Data_Transfer2/U_Single_Mux (18 pins), Data_Conversion_BottomBoard (7 pins)
ADC_OUTA: Data_Transfer1/U_Single_Mux (R1_1.1 TP12_1.1 U3_1.3), Data_Conversion_BottomBoard (P1.1 P7.5)
ADC_OUTA: Data_Transfer2/U_Single_Mux (R1_2.1 TP12_2.1 U3_2.3), Data_Conversion_BottomBoard (P1.6 P7.3)
ADC_OUTB: Data_Transfer1/U_Single_Mux (R2_1.1 TP17_1.1 U4_1.3), Data_Conversion_BottomBoard (P1.2 P7.6)
ADC_OUTB: Data_Transfer2/U_Single_Mux (R2_2.1 TP17_2.1 U4_2.3), Data_Conversion_BottomBoard (P1.3 P7.4)
ADC_OUTC: Data_Transfer1/U_Single_Mux (R3_1.1 TP19_1.1 U5_1.3), Data_Conversion_BottomBoard (P1.5 P7.2)
ADC_OUTC: Data_Transfer2/U_Single_Mux (R3_2.1 TP19_2.1 U5_2.3), Data_Conversion_BottomBoard (P1.4 P7.1)
TS_IN1: Data_Transfer1/U_AHK50H-ND_THERM_CONNECTOR (P2_1.1), Data_Transfer1/U_Single_Mux (U3_1.13)
TS_IN1: Data_Transfer2/U_AHK50H-ND_THERM_CONNECTOR (P2_2.1), Data_Transfer2/U_Single_Mux (U3_2.13)
TS_IN2: Data_Transfer1/U_AHK50H-ND_THERM_CONNECTOR (P2_1.2), Data_Transfer1/U_Single_Mux (U3_1.14)
TS_IN2: Data_Transfer2/U_AHK50H-ND_THERM_CONNECTOR (P2_2.2), Data_Transfer2/U_Single_Mux (U3_2.14)
TS_IN3: Data_Transfer1/U_AHK50H-ND_THERM_CONNECTOR (P2_1.3), Data_Transfer1/U_Single_Mux (U3_1.15)
TS_IN3: Data_Transfer2/U_AHK50H-ND_THERM_CONNECTOR (P2_2.3), Data_Transfer2/U_Single_Mux (U3_2.15)
TS_IN4: Data_Transfer1/U_AHK50H-ND_THERM_CONNECTOR (P2_1.4), Data_Transfer1/U_Single_Mux (U3_1.12)
TS_IN4: Data_Transfer2/U_AHK50H-ND_THERM_CONNECTOR (P2_2.4), Data_Transfer2/U_Single_Mux (U3_2.12)
TS_IN5: Data_Transfer1/U_AHK50H-ND_THERM_CONNECTOR (P2_1.5), Data_Transfer1/U_Single_Mux (U3_1.1)
TS_IN5: Data_Transfer2/U_AHK50H-ND_THERM_CONNECTOR (P2_2.5), Data_Transfer2/U_Single_Mux (U3_2.1)
TS_IN6: Data_Transfer1/U_AHK50H-ND_THERM_CONNECTOR (P2_1.6), Data_Transfer1/U_Single_Mux (U3_1.5)
TS_IN6: Data_Transfer2/U_AHK50H-ND_THERM_CONNECTOR (P2_2.6), Data_Transfer2/U_Single_Mux (U3_2.5)
TS_IN7: Data_Transfer1/U_AHK50H-ND_THERM_CONNECTOR (P2_1.7), Data_Transfer1/U_Single_Mux (U3_1.2)
TS_IN7: Data_Transfer2/U_AHK50H-ND_THERM_CONNECTOR (P2_2.7), Data_Transfer2/U_Single_Mux (U3_2.2)
TS_IN8: Data_Transfer1/U_AHK50H-ND_THERM_CONNECTOR (P2_1.8), Data_Transfer1/U_Single_Mux (U3_1.4)
TS_IN8: Data_Transfer2/U_AHK50H-ND_THERM_CONNECTOR (P2_2.8), Data_Transfer2/U_Single_Mux (U3_2.4)
TS_IN9: Data_Transfer1/U_AHK50H-ND_THERM_CONNECTOR (P2_1.9), Data_Transfer1/U_Single_Mux (U4_1.13)
TS_IN9: Data_Transfer2/U_AHK50H-ND_THERM_CONNECTOR (P2_2.9), Data_Transfer2/U_Single_Mux (U4_2.13)
TS_IN10: Data_Transfer1/U_AHK50H-ND_THERM_CONNECTOR (P2_1.10), Data_Transfer1/U_Single_Mux (U4_1.14)
TS_IN10: Data_Transfer2/U_AHK50H-ND_THERM_CONNECTOR (P2_2.10), Data_Transfer2/U_Single_Mux (U4_2.14)
TS_IN11: Data_Transfer1/U_AHK50H-ND_THERM_CONNECTOR (P2_1.11), Data_Transfer1/U_Single_Mux (U4_1.15)
TS_IN11: Data_Transfer2/U_AHK50H-ND_THERM_CONNECTOR (P2_2.11), Data_Transfer2/U_Single_Mux (U4_2.15)
TS_IN12: Data_Transfer1/U_AHK50H-ND_THERM_CONNECTOR (P2_1.12), Data_Transfer1/U_Single_Mux (U4_1.12)
TS_IN12: Data_Transfer2/U_AHK50H-ND_THERM_CONNECTOR (P2_2.12), Data_Transfer2/U_Single_Mux (U4_2.12)
TS_IN13: Data_Transfer1/U_AHK50H-ND_THERM_CONNECTOR (P2_1.13), Data_Transfer1/U_Single_Mux (U4_1.1)
TS_IN13: Data_Transfer2/U_AHK50H-ND_THERM_CONNECTOR (P2_2.13), Data_Transfer2/U_Single_Mux (U4_2.1)
TS_IN14: Data_Transfer1/U_AHK50H-ND_THERM_CONNECTOR (P2_1.14), Data_Transfer1/U_Single_Mux (U4_1.5)
TS_IN14: Data_Transfer2/U_AHK50H-ND_THERM_CONNECTOR (P2_2.14), Data_Transfer2/U_Single_Mux (U4_2.5)
TS_IN15: Data_Transfer1/U_AHK50H-ND_THERM_CONNECTOR (P2_1.15), Data_Transfer1/U_Single_Mux (U4_1.2)
TS_IN15: Data_Transfer2/U_AHK50H-ND_THERM_CONNECTOR (P2_2.15), Data_Transfer2/U_Single_Mux (U4_2.2)
TS_IN16: Data_Transfer1/U_AHK50H-ND_THERM_CONNECTOR (P2_1.16), Data_Transfer1/U_Single_Mux (U4_1.4)
TS_IN16: Data_Transfer2/U_AHK50H-ND_THERM_CONNECTOR (P2_2.16), Data_Transfer2/U_Single_Mux (U4_2.4)
TS_IN17: Data_Transfer1/U_AHK50H-ND_THERM_CONNECTOR (P2_1.17), Data_Transfer1/U_Single_Mux (U5_1.13)
TS_IN17: Data_Transfer2/U_AHK50H-ND_THERM_CONNECTOR (P2_2.17), Data_Transfer2/U_Single_Mux (U5_2.13)
TS_IN18: Data_Transfer1/U_AHK50H-ND_THERM_CONNECTOR (P2_1.18), Data_Transfer1/U_Single_Mux (U5_1.14)
TS_IN18: Data_Transfer2/U_AHK50H-ND_THERM_CONNECTOR (P2_2.18), Data_Transfer2/U_Single_Mux (U5_2.14)
TS_IN19: Data_Transfer1/U_AHK50H-ND_THERM_CONNECTOR (P2_1.19), Data_Transfer1/U_Single_Mux (U5_1.15)
TS_IN19: Data_Transfer2/U_AHK50H-ND_THERM_CONNECTOR (P2_2.19), Data_Transfer2/U_Single_Mux (U5_2.15)
TS_IN20: Data_Transfer1/U_AHK50H-ND_THERM_CONNECTOR (P2_1.20), Data_Transfer1/U_Single_Mux (U5_1.12)
TS_IN20: Data_Transfer2/U_AHK50H-ND_THERM_CONNECTOR (P2_2.20), Data_Transfer2/U_Single_Mux (U5_2.12)
TS_IN21: Data_Transfer1/U_AHK50H-ND_THERM_CONNECTOR (P2_1.21), Data_Transfer1/U_Single_Mux (U5_1.1)
TS_IN21: Data_Transfer2/U_AHK50H-ND_THERM_CONNECTOR (P2_2.21), Data_Transfer2/U_Single_Mux (U5_2.1)
TS_IN22: Data_Transfer1/U_AHK50H-ND_THERM_CONNECTOR (P2_1.22), Data_Transfer1/U_Single_Mux (U5_1.5)
TS_IN22: Data_Transfer2/U_AHK50H-ND_THERM_CONNECTOR (P2_2.22), Data_Transfer2/U_Single_Mux (U5_2.5)